# Altium schematic sheet MainControl A3.SchDoc
size A3
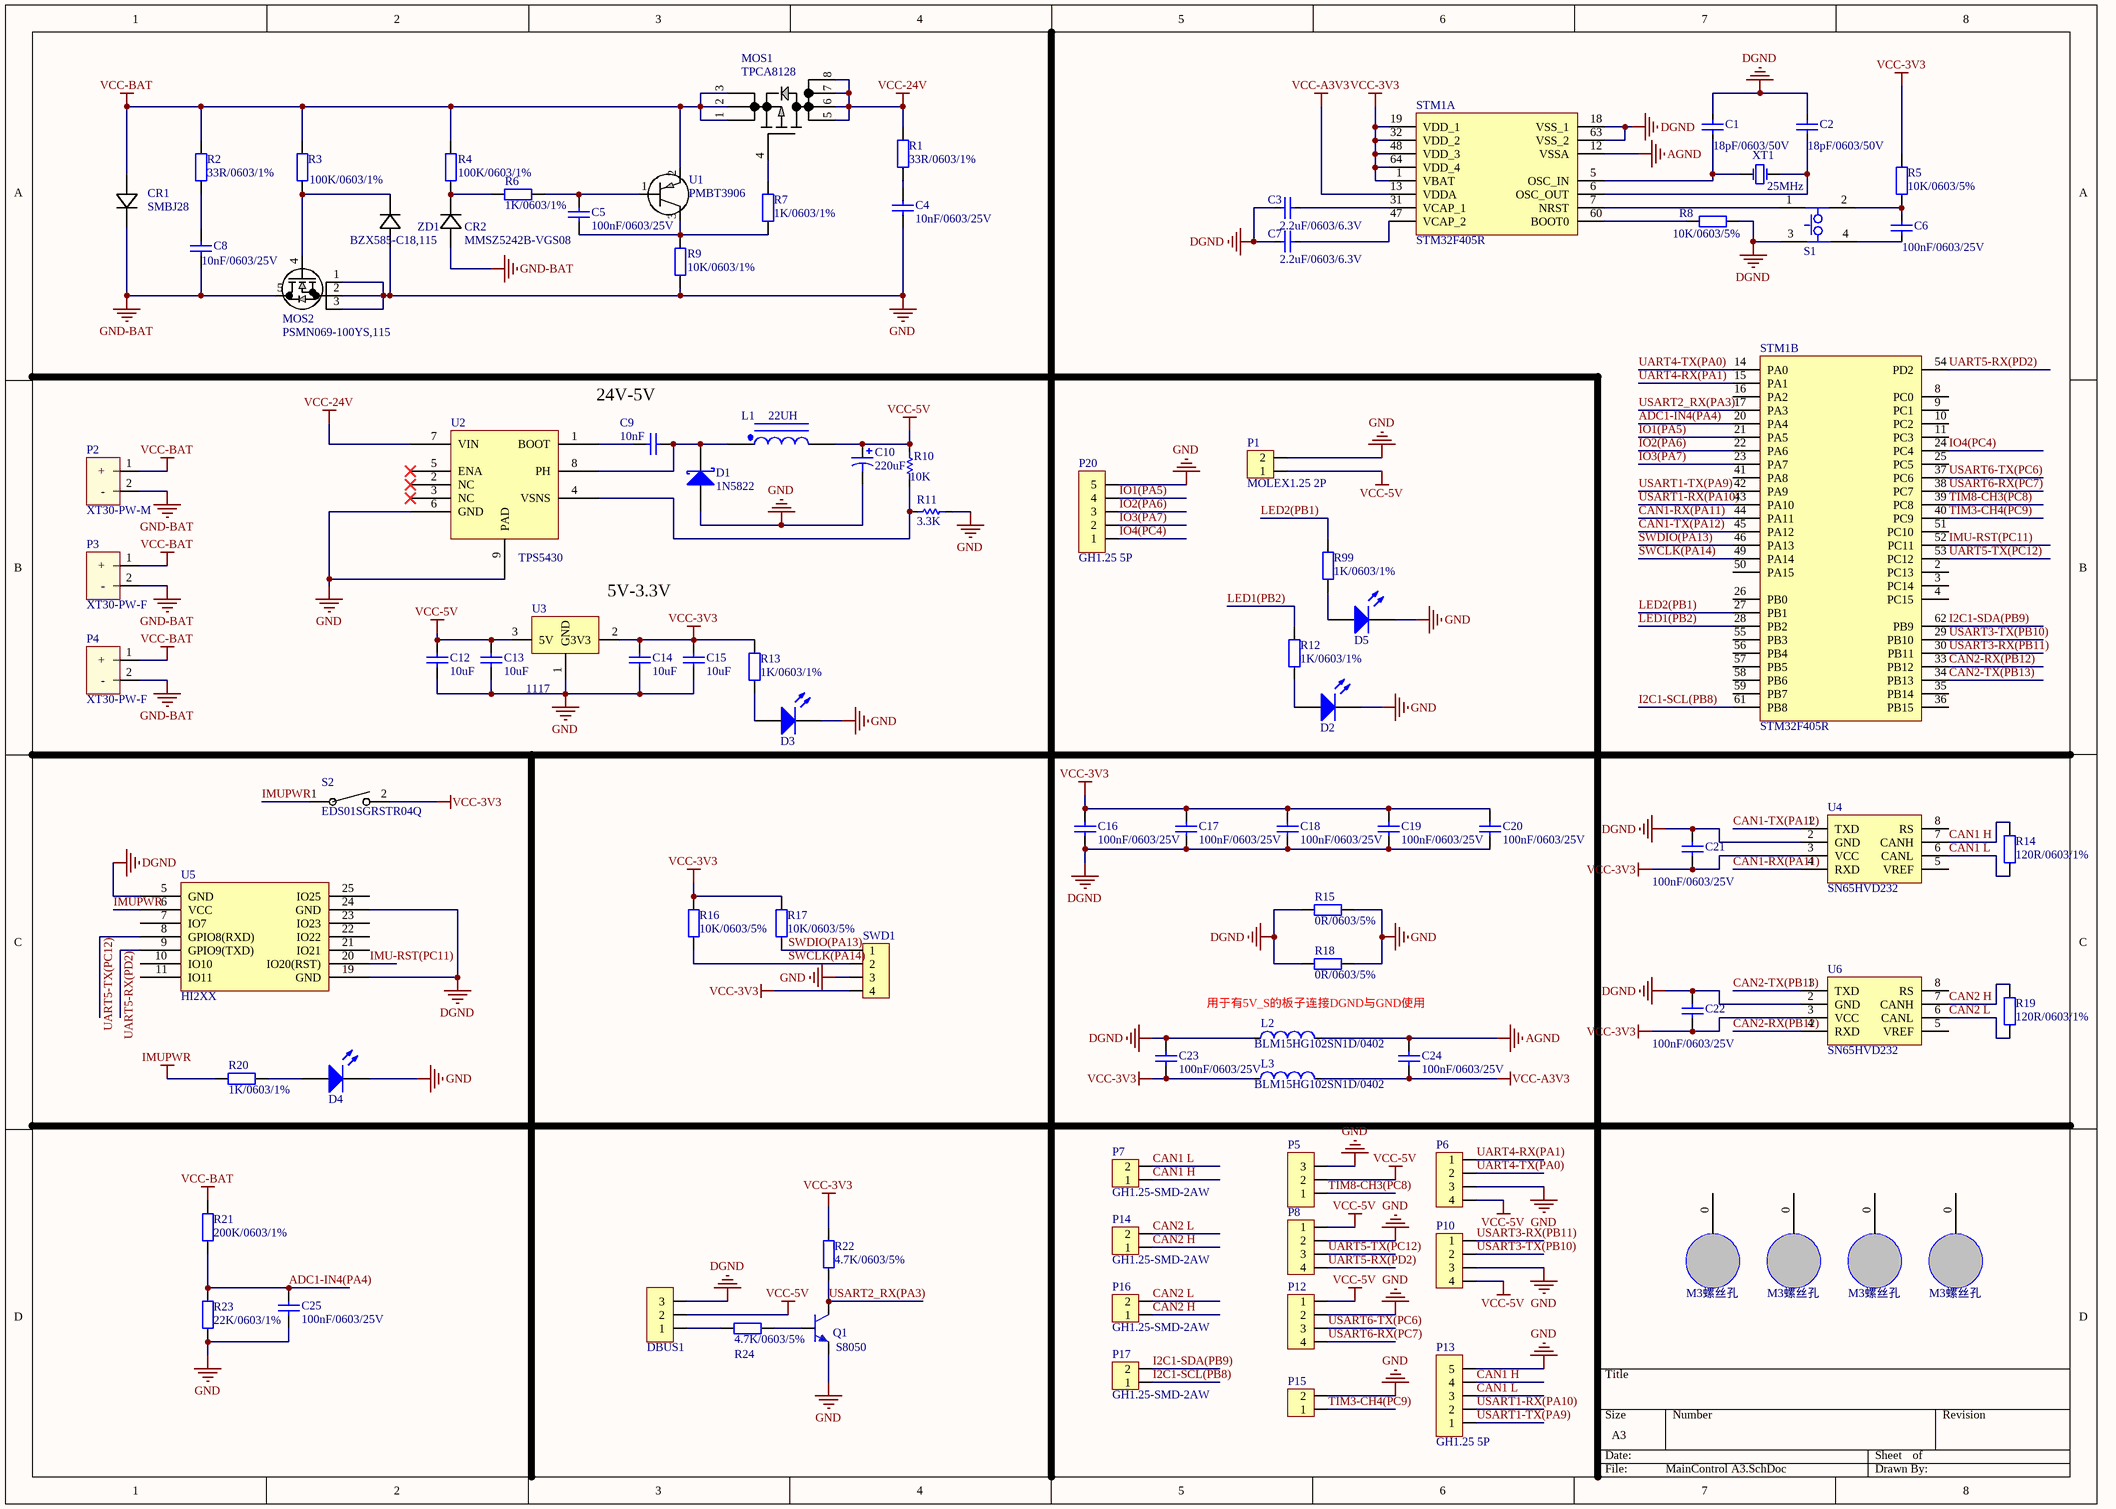
[diagram p0: MainControl A3.SchDoc]

## Parts
C1  value 18pF/0603/50V  [C-SMD-0603]  (hidden comment: 18pF)
C2  value 18pF/0603/50V  [C-SMD-0603]  (hidden comment: 18pF)
C3  value 2.2uF/0603/6.3V  [C-SMD-0603]  (hidden comment: 2.2uF)
C4  value 10nF/0603/25V  [C-SMD-0603]  (hidden comment: 10nF)
C5  value 100nF/0603/25V  [C-SMD-0603]  (hidden comment: 100nF)
C6  value 100nF/0603/25V  [C-SMD-0603]  (hidden comment: 100nF)
C7  value 2.2uF/0603/6.3V  [C-SMD-0603]  (hidden comment: 2.2uF)
C8  value 10nF/0603/25V  [C-SMD-0603]  (hidden comment: 10nF)
C9  10nF  [C-SMD-0603]
C10  220uF  [TCAP7343]
C12  10uF  [C-SMD-0603]
C13  10uF  [C-SMD-0603]
C14  10uF  [C-SMD-0603]
C15  10uF  [C-SMD-0603]
C16  value 100nF/0603/25V  [C-SMD-0603]  (hidden comment: 100nF)
C17  value 100nF/0603/25V  [C-SMD-0603]  (hidden comment: 100nF)
C18  value 100nF/0603/25V  [C-SMD-0603]  (hidden comment: 100nF)
C19  value 100nF/0603/25V  [C-SMD-0603]  (hidden comment: 100nF)
C20  value 100nF/0603/25V  [C-SMD-0603]  (hidden comment: 100nF)
C21  value 100nF/0603/25V  [C-SMD-0603]  (hidden comment: 100NF)
C22  value 100nF/0603/25V  [C-SMD-0603]  (hidden comment: 100NF)
C23  value 100nF/0603/25V  [C-SMD-0603]  (hidden comment: 100nF)
C24  value 100nF/0603/25V  [C-SMD-0603]  (hidden comment: 100nF)
C25  value 100nF/0603/25V  [C-SMD-0603]  (hidden comment: 100nF)
CR1  SMBJ28  [SMBJSeries_LTF]
CR2  MMSZ5242B-VGS08  [SOD123_MMS]
D1  1N5822  [SS34]
D2  LED0  [LED-0603]  (value not drawn)
D3  LED0  [LED-0603]  (value not drawn)
D4  LED0  [LED-0603]  (value not drawn)
D5  LED0  [LED-0603]  (value not drawn)
DBUS1  Header 3  [HDR1x3]  (value not drawn)
L1  22UH  [L-7070]
L2  value BLM15HG102SN1D/0402  [l-SMD-0402]  (hidden comment: BLM15HG102SN1D)
L3  value BLM15HG102SN1D/0402  [l-SMD-0402]  (hidden comment: BLM15HG102SN1D)
M1  M3螺丝孔  [M3螺丝]
M2  M3螺丝孔  [M3螺丝]
M3  M3螺丝孔  [M3螺丝]
M4  M3螺丝孔  [M3螺丝]
MOS1  TPCA8128  [SOP Advance_TOS]
MOS2  PSMN069-100YS,115  [LFPAK56_POWER-SO8_SOT669_NEX]
P1  MOLEX1.25 2P  [MOLEX1.25-2P]
P2  XT30-PW-M  [XT30PW-M]
P3  XT30-PW-F  [XT30PW-F]
P4  XT30-PW-F  [XT30PW-F]
P5  Header 3  [HDR1X3]  (value not drawn)
P6  GH1.25-SMD-4AW  [GH1.25-SMD-4AW]  (value not drawn)
P7  GH1.25-SMD-2AW  [GH1.25-SMD-2AW]
P8  GH1.25-SMD-4AW  [GH1.25-SMD-4AW]  (value not drawn)
P10  GH1.25-SMD-4AW  [GH1.25-SMD-4AW]  (value not drawn)
P12  GH1.25-SMD-4AW  [GH1.25-SMD-4AW]  (value not drawn)
P13  GH1.25 5P  [GH1.25-SMD-5AW]
P14  GH1.25-SMD-2AW  [GH1.25-SMD-2AW]
P15  GH1.25-SMD-2AW  [GH1.25-SMD-2AW]  (value not drawn)
P16  GH1.25-SMD-2AW  [GH1.25-SMD-2AW]
P17  GH1.25-SMD-2AW  [GH1.25-SMD-2AW]
P20  GH1.25 5P  [GH1.25-SMD-5AW]
Q1  S8050  [SOT23-3]
R1  value 33R/0603/1%  [R-SMD-0603]  (hidden comment: 33R)
R2  value 33R/0603/1%  [R-SMD-0603]  (hidden comment: 33R)
R3  value 100K/0603/1%  [R-SMD-0603]  (hidden comment: 100K)
R4  value 100K/0603/1%  [R-SMD-0603]  (hidden comment: 100K)
R5  value 10K/0603/5%  [R-SMD-0603]  (hidden comment: 10K)
R6  value 1K/0603/1%  [R-SMD-0603]  (hidden comment: 1K)
R7  value 1K/0603/1%  [R-SMD-0603]  (hidden comment: 1K)
R8  value 10K/0603/5%  [R-SMD-0603]  (hidden comment: 10K)
R9  value 10K/0603/1%  [R-SMD-0603]  (hidden comment: 10K)
R10  10K  [R-SMD-0603]
R11  3.3K  [R-SMD-0603]
R12  value 1K/0603/1%  [R-SMD-0603]  (hidden comment: 1K)
R13  value 1K/0603/1%  [R-SMD-0603]  (hidden comment: 1K)
R14  value 120R/0603/1%  [R-SMD-0603]  (hidden comment: 120R)
R15  value 0R/0603/5%  [R-SMD-0603]  (hidden comment: 0R)
R16  value 10K/0603/5%  [R-SMD-0603]  (hidden comment: 10K)
R17  value 10K/0603/5%  [R-SMD-0603]  (hidden comment: 10K)
R18  value 0R/0603/5%  [R-SMD-0603]  (hidden comment: 0R)
R19  value 120R/0603/1%  [R-SMD-0603]  (hidden comment: 120R)
R20  value 1K/0603/1%  [R-SMD-0603]  (hidden comment: 1K)
R21  value 200K/0603/1%  [R-SMD-0603]  (hidden comment: 200K)
R22  value 4.7K/0603/5%  [R-SMD-0603]  (hidden comment: 4.7K)
R23  value 22K/0603/1%  [R-SMD-0603]  (hidden comment: 22K)
R24  value 4.7K/0603/5%  [R-SMD-0603]  (hidden comment: 4.7K)
R99  value 1K/0603/1%  [R-SMD-0603]  (hidden comment: 1K)
S1  SKRPADE010  [SKRPADE010]  (value not drawn)
S2  EDS01SGRSTR04Q  [SW1_EDS01SGRSTR04Q_TEC-M]
STM1  STM32F405R  [LQFP64]  (parts A,B of 2)
SWD1  GH1.25-SMD-4AW  [molex1.25-4p]  (value not drawn)
U1  PMBT3906  [SOT23_NEX]
U2  TPS5430  [TPS5430]
U3  1117  [AMS1117]
U4  SN65HVD232  [SOP-8]
U5  HI2XX  [HI2XX_PLCC28]
U6  SN65HVD232  [SOP-8]
XT1  25MHz  [XTAL3225]
ZD1  BZX585-C18,115  [CR_85-C18,115_NEX]

## Nets
AGND: C24.2 L2.2 STM1.12(VSSA)
DGND: C1.2 C2.2 C3.2 C7.2 C16.1 C17.1 C18.1 C19.1 C20.1 C21.2 C22.2 C23.2 DBUS1.3 L2.1 R8.1 R15.1 R18.1 S1.3(B1) STM1.18(VSS_1) STM1.63(VSS_2) U4.2(GND) U5.5(GND) U5.19(GND) U5.24(GND) U6.2(GND)
GND: C4.1 C10.2 C12.1 C13.1 C14.1 C15.1 C25.1 D1.1(A) D2.2(K) D3.2(K) D4.2(K) D5.2(K) MOS2.1(S) MOS2.2(S) MOS2.3(S) P1.2 P5.3 P6.3 P8.2 P10.3 P12.2 P13.5 P15.2 P20.5 Q1.2(E) R9.2 R11.1(TOP) R15.2 R18.2 R23.1 SWD1.3 U2.6(GND) U2.9(PAD) U3.1(GND) ZD1.2
GND-BAT: C8.1 CR1.1 CR2.2 MOS2.5(D) P2.2(-) P3.2(-) P4.2(-)
IMUPWR: R20.1 S2.1 U5.6(VCC)
VCC-3V3: C14.2 C15.2 C16.2 C17.2 C18.2 C19.2 C20.2 C21.1 C22.1 C23.1 L3.1 R5.2 R13.1 R16.1 R17.1 R22.1 S2.2 STM1.1(VBAT) STM1.19(VDD_1) STM1.32(VDD_2) STM1.48(VDD_3) STM1.64(VDD_4) SWD1.4 U3.2(3V3) U4.3(VCC) U6.3(VCC)
VCC-5V: C10.1 C12.2 C13.2 DBUS1.2 L1.2 P1.1 P5.2 P6.4 P8.1 P10.4 P12.1 R10.1(TOP) U3.3(5V)
VCC-24V: MOS1.5 MOS1.6 MOS1.7 MOS1.8 R1.1 U2.7(VIN)
VCC-A3V3: C24.1 L3.2 STM1.13(VDDA)
VCC-BAT: CR1.2 MOS1.1 MOS1.2 MOS1.3 P2.1(+) P3.1(+) P4.1(+) R2.1 R3.1 R4.1 R21.2 U1.2
ADC1-IN4(PA4): C25.2 R21.1 R23.2 STM1.20(PA4)
CAN1 H: P7.1 P13.4 R14.2 U4.7(CANH)
CAN1 L: P7.2 P13.3 R14.1 U4.6(CANL)
CAN1-RX(PA11): STM1.44(PA11) U4.4(RXD)
CAN1-TX(PA12): STM1.45(PA12) U4.1(TXD)
CAN2 H: P14.1 P16.1 R19.2 U6.7(CANH)
CAN2 L: P14.2 P16.2 R19.1 U6.6(CANL)
CAN2-RX(PB12): STM1.33(PB12) U6.4(RXD)
CAN2-TX(PB13): STM1.34(PB13) U6.1(TXD)
I2C1-SCL(PB8): P17.1 STM1.61(PB8)
I2C1-SDA(PB9): P17.2 STM1.62(PB9)
IMU-RST(PC11): STM1.52(PC11) U5.20(IO20(RST))
IO1(PA5): P20.4 STM1.21(PA5)
IO2(PA6): P20.3 STM1.22(PA6)
IO3(PA7): P20.2 STM1.23(PA7)
IO4(PC4): P20.1 STM1.24(PC4)
LED1(PB2): R12.1 STM1.28(PB2)
LED2(PB1): R99.1 STM1.27(PB1)
SWCLK(PA14): R16.2 STM1.49(PA14) SWD1.2
SWDIO(PA13): R17.2 STM1.46(PA13) SWD1.1
TIM3-CH4(PC9): P15.1 STM1.40(PC9)
TIM8-CH3(PC8): P5.1 STM1.39(PC8)
UART4-RX(PA1): P6.1 STM1.15(PA1)
UART4-TX(PA0): P6.2 STM1.14(PA0)
UART5-RX(PD2): P8.4 STM1.54(PD2) U5.9(GPIO9(TXD))
UART5-TX(PC12): P8.3 STM1.53(PC12) U5.8(GPIO8(RXD))
USART1-RX(PA10): P13.2 STM1.43(PA10)
USART1-TX(PA9): P13.1 STM1.42(PA9)
USART2_RX(PA3): Q1.3(C) R22.2 STM1.17(PA3)
USART3-RX(PB11): P10.1 STM1.30(PB11)
USART3-TX(PB10): P10.2 STM1.29(PB10)
USART6-RX(PC7): P12.4 STM1.38(PC7)
USART6-TX(PC6): P12.3 STM1.37(PC6)
NetC1_1: C1.1 STM1.5(OSC_IN) XT1.1(OSC1)
NetC2_1: C2.1 STM1.6(OSC_OUT) XT1.3(OSC2)
NetC3_1: C3.1 STM1.31(VCAP_1)
NetC4_2: C4.2 R1.2
NetC5_1: C5.1 R7.1 R9.1 U1.3
NetC5_2: C5.2 R6.2 U1.1
NetC6_1: C6.1 S1.4(B2)
NetC6_2: C6.2 R5.1 S1.2(A2)
NetC7_1: C7.1 STM1.47(VCAP_2)
NetC8_2: C8.2 R2.2
NetC9_1: C9.1 U2.1(BOOT)
NetC9_2: C9.2 D1.2(K) L1.1 U2.8(PH)
NetCR2_1: CR2.1 R4.2 R6.1
NetD2_1: D2.1(A) R12.2
NetD3_1: D3.1(A) R13.2
NetD4_1: D4.1(A) R20.2
NetD5_1: D5.1(A) R99.2
NetDBUS1_1: DBUS1.1 R24.2
NetMOS1_4: MOS1.4 R7.2
NetMOS2_4: MOS2.4(G) R3.2 ZD1.1
NetQ1_1: Q1.1(B) R24.1
NetR8_2: R8.2 STM1.60(BOOT0)
NetR10_2: R10.2(BOT) R11.2(BOT) U2.4(VSNS)
NetS1_1: S1.1(A1) STM1.7(NRST)

Not connected (* = marked no-connect by the designer): M1 0; M2 0; M3 0; M4 0; STM1 2(PC13) 3(PC14) 4(PC15) 8(PC0) 9(PC1) 10(PC2) 11(PC3) 16(PA2) 25(PC5) 26(PB0) 35(PB14) 36(PB15) 41(PA8) 50(PA15) 51(PC10) 55(PB3) 56(PB4) 57(PB5) 58(PB6) 59(PB7); U2 2(NC)* 3(NC)* 5(ENA)*; U4 5(VREF) 8(RS); U5 7(IO7) 10(IO10) 11(IO11) 21(IO21) 22(IO22) 23(IO23) 25(IO25); U6 5(VREF) 8(RS)

## Notes on the sheet
- 24V-5V
- 5V-3.3V
- 用于有5V_S的板子连接DGND与GND使用

## Library data of the parts
C1-C3 C6 C7 = Cap_0402: Capacitor
C4 C5 C8 C16-C25 = Cap: 贴片电容; Published: 8-Jun-2000; LatestRevisionDate: 17-Jul-2002; LatestRevisionNote: Re-released for DXP Platform.; PackageReference: RAD-0.3; Publisher: Altium Limited; PackageDescription: Radial Cap, Thru-Hole; 2 Leads; 0.3 in Pin Spacing
C9 = Cap: 无极性电容; value: 103; Published: 8-Jun-2000; LatestRevisionDate: 17-Jul-2002; LatestRevisionNote: Re-released for DXP Platform.; PackageReference: RAD-0.3; Publisher: Altium Limited
C10 = Cap Pol1: Polarized Capacitor (Radial); Published: 8-Jun-2000; LatestRevisionDate: 17-Jul-2002; LatestRevisionNote: Re-released for DXP Platform.; PackageReference: RB7.6-15; Publisher: Altium Limited; PackageDescription: Polarized Capacitor (Radial); 2 Leads; Value: 220uF
C12-C15 = Cap: 无极性电容; Published: 8-Jun-2000; LatestRevisionDate: 17-Jul-2002; LatestRevisionNote: Re-released for DXP Platform.; PackageReference: RAD-0.3; Publisher: Altium Limited; value: 10uf
CR1 = SMBJ10: No Description Available; Vendor: Littelfuse Inc; Built_By: EMA_UL_Team; SourceLibrary: LittleFuse_2015-04-13; Type: DEV; Manufacturer_Part_Number: SMBJ10; Copyright: Copyright (C) 2018 Accelerated Designs. All rights reserved; RefDes: RefDes
CR2 = MMSZ5242B-VGS08: No Description Available; Vendor: Vishay; Built_By: EMA_UL_Team; Type: DEV; Manufacturer_Part_Number: MMSZ5242B-VGS08; Copyright: Copyright (C) 2018 Accelerated Designs. All rights reserved; RefDes: RefDes
D1 = D Schottky: Schottky Diode; value: ss34; Published: 8-Jun-2000; LatestRevisionDate: 17-Jul-2002; LatestRevisionNote: Re-released for DXP Platform.; PackageReference: SMB; Publisher: Altium Limited; PackageDescription: DO-214-AA/SMB; 2 C-Bend Leads; Body 5.3 x 3.6 mm, inc. leads (LxW); Code_JEDEC: DO-214-AA
D2-D5 = LED0: 发光二极管; Published: 8-Jun-2000; LatestRevisionDate: 08-Jul-2005; LatestRevisionNote: Mech Layer 1 removed.; PackageReference: LED-0; Publisher: Altium Limited
DBUS1 P5 = Header 3: Header; LatestRevisionDate: 17-Jul-2002; LatestRevisionNote: Re-released for DXP Platform.; Publisher: Altium Limited
L1 = Inductor Iron Dot: Magnetic-Core Inductor with Winding Polarity Marking; Published: 24-Mar-1999; LatestRevisionDate: 17-Jul-2002; LatestRevisionNote: Re-released for DXP Platform.; PackageReference: DIODE_SMC; Publisher: Altium Limited; PackageDescription: Diode; 2 Leads
L2 L3 = BLM15HG102SN1D/0402: Inductor
MOS1 = TPCA8128: No Description Available; Vendor: Toshiba; Built_By: EMA_UL_Team; SourceLibrary: Toshiba_2019-12-10; Source_Package: PMOS_TPCA8128; Number_devices_in_Package: 1; Manufacturer_Part_Number: TPCA8128; Copyright: Copyright (C) 2018 Accelerated Designs. All rights reserved; RefDes: RefDes; Type: DEV
MOS2 = PSMN069-100YS,115: No Description Available; Vendor: Nexperia; Built_By: EMA_Cory; SourceLibrary: Nexperia_2019-12-03; Manufacturer_Part_Number: PSMN069-100YS,115; Copyright: Copyright (C) 2018 Accelerated Designs. All rights reserved; RefDes: RefDes; Type: DEV
P1 P7 P14-P17 = GH1.25-SMD-2AW: pitch 1.25mm，2P，公座（A代表公，Y代表母），卧贴
P2-P4 = XT30-F: 2P电源连接器母座
P6 P8 P10 P12 SWD1 = GH1.25-SMD-4AW: pitch 1.25mm，4P，公座（A代表公，Y代表母），卧贴
Q1 = BJT_NPN: Transistor; value: S8050
R1-R4 R6 R7 R9-R13 R20 R21 R23 R99 = Res1: 贴片电阻; Published: 8-Jun-2000; LatestRevisionDate: 17-Jul-2002; LatestRevisionNote: Re-released for DXP Platform.; PackageReference: AXIAL-0.4; Publisher: Altium Limited
  R10: Value: 10K
  R11: value: 3.3K
R5 R8 R16 R17 = Res_0402: Resistor
R14 R19 = Res: 贴片电阻
R15 R18 R22 R24 = Res_0603: Resistor
S1 = SKRPADE010: Switch; Published: 24-Mar-1999; LatestRevisionDate: 17-Jul-2002; LatestRevisionNote: Re-released for DXP Platform.; PackageReference: DIP-4; Publisher: Altium Limited
S2 = EDS01SGRSTR04Q: No Description Available; Vendor: TE Connectivity; Built_By: EMA_Kyle; SourceLibrary: Add_to_database_2020-11-10; Datasheet: https://www.te.com/commerce/DocumentDelivery/DDEController?Action=showdoc&DocId=Customer+Drawing%7F2319848%7FA1%7Fpdf%7FEnglish%7FENG_CD_2319848_A1.pdf%7F6-2319848-4; Manufacturer_Part_Number: EDS01SGRSTR04Q; Copyright: Copyright (C) 2018 Accelerated Designs. All rights reserved; RefDes: RefDes; Type: DEV
STM1 = STM32F405R: MCU
U1 = PMBT3906: No Description Available; Vendor: Nexperia; SourceLibrary: Nexperia_2018-05-2018; Manufacturer_Part_Number: PMBT3906; Copyright: Copyright (C) 2016 Accelerated Designs. All rights reserved; RefDes: RefDes; Type: DEV
U3 = AMS1117-3.3
U4 U6 = SN65HVD232: CAN
XT1 = XTAL_5032: Crystal Oscillator; Published: 8-Jun-2000; LatestRevisionDate: 17-Jul-2002; LatestRevisionNote: Re-released for DXP Platform.; PackageReference: R38; Publisher: Altium Limited; PackageDescription: Crystal, Thru-Hole; 2 Leads; Body 3.1 x 8.2 mm (Dia.xH); Value: 25MHz
ZD1 = BZX585-C18,115: No Description Available; Built_By: EMA_Matt; Vendor: Nexperia; SourceLibrary: Add_to_database_2020-12-03; Datasheet: https://www.mouser.com/datasheet/2/916/BZX585_SERIES-1599076.pdf; Copyright: Copyright (C) 2018 Accelerated Designs. All rights reserved; Manufacturer_Part_Number: BZX585-C18,115; RefDes: RefDes; Type: DEV